# Altium schematic sheet CHARGER_BOARD.SchDoc
size A3; SheetNumber: 1; SheetTotal: 1
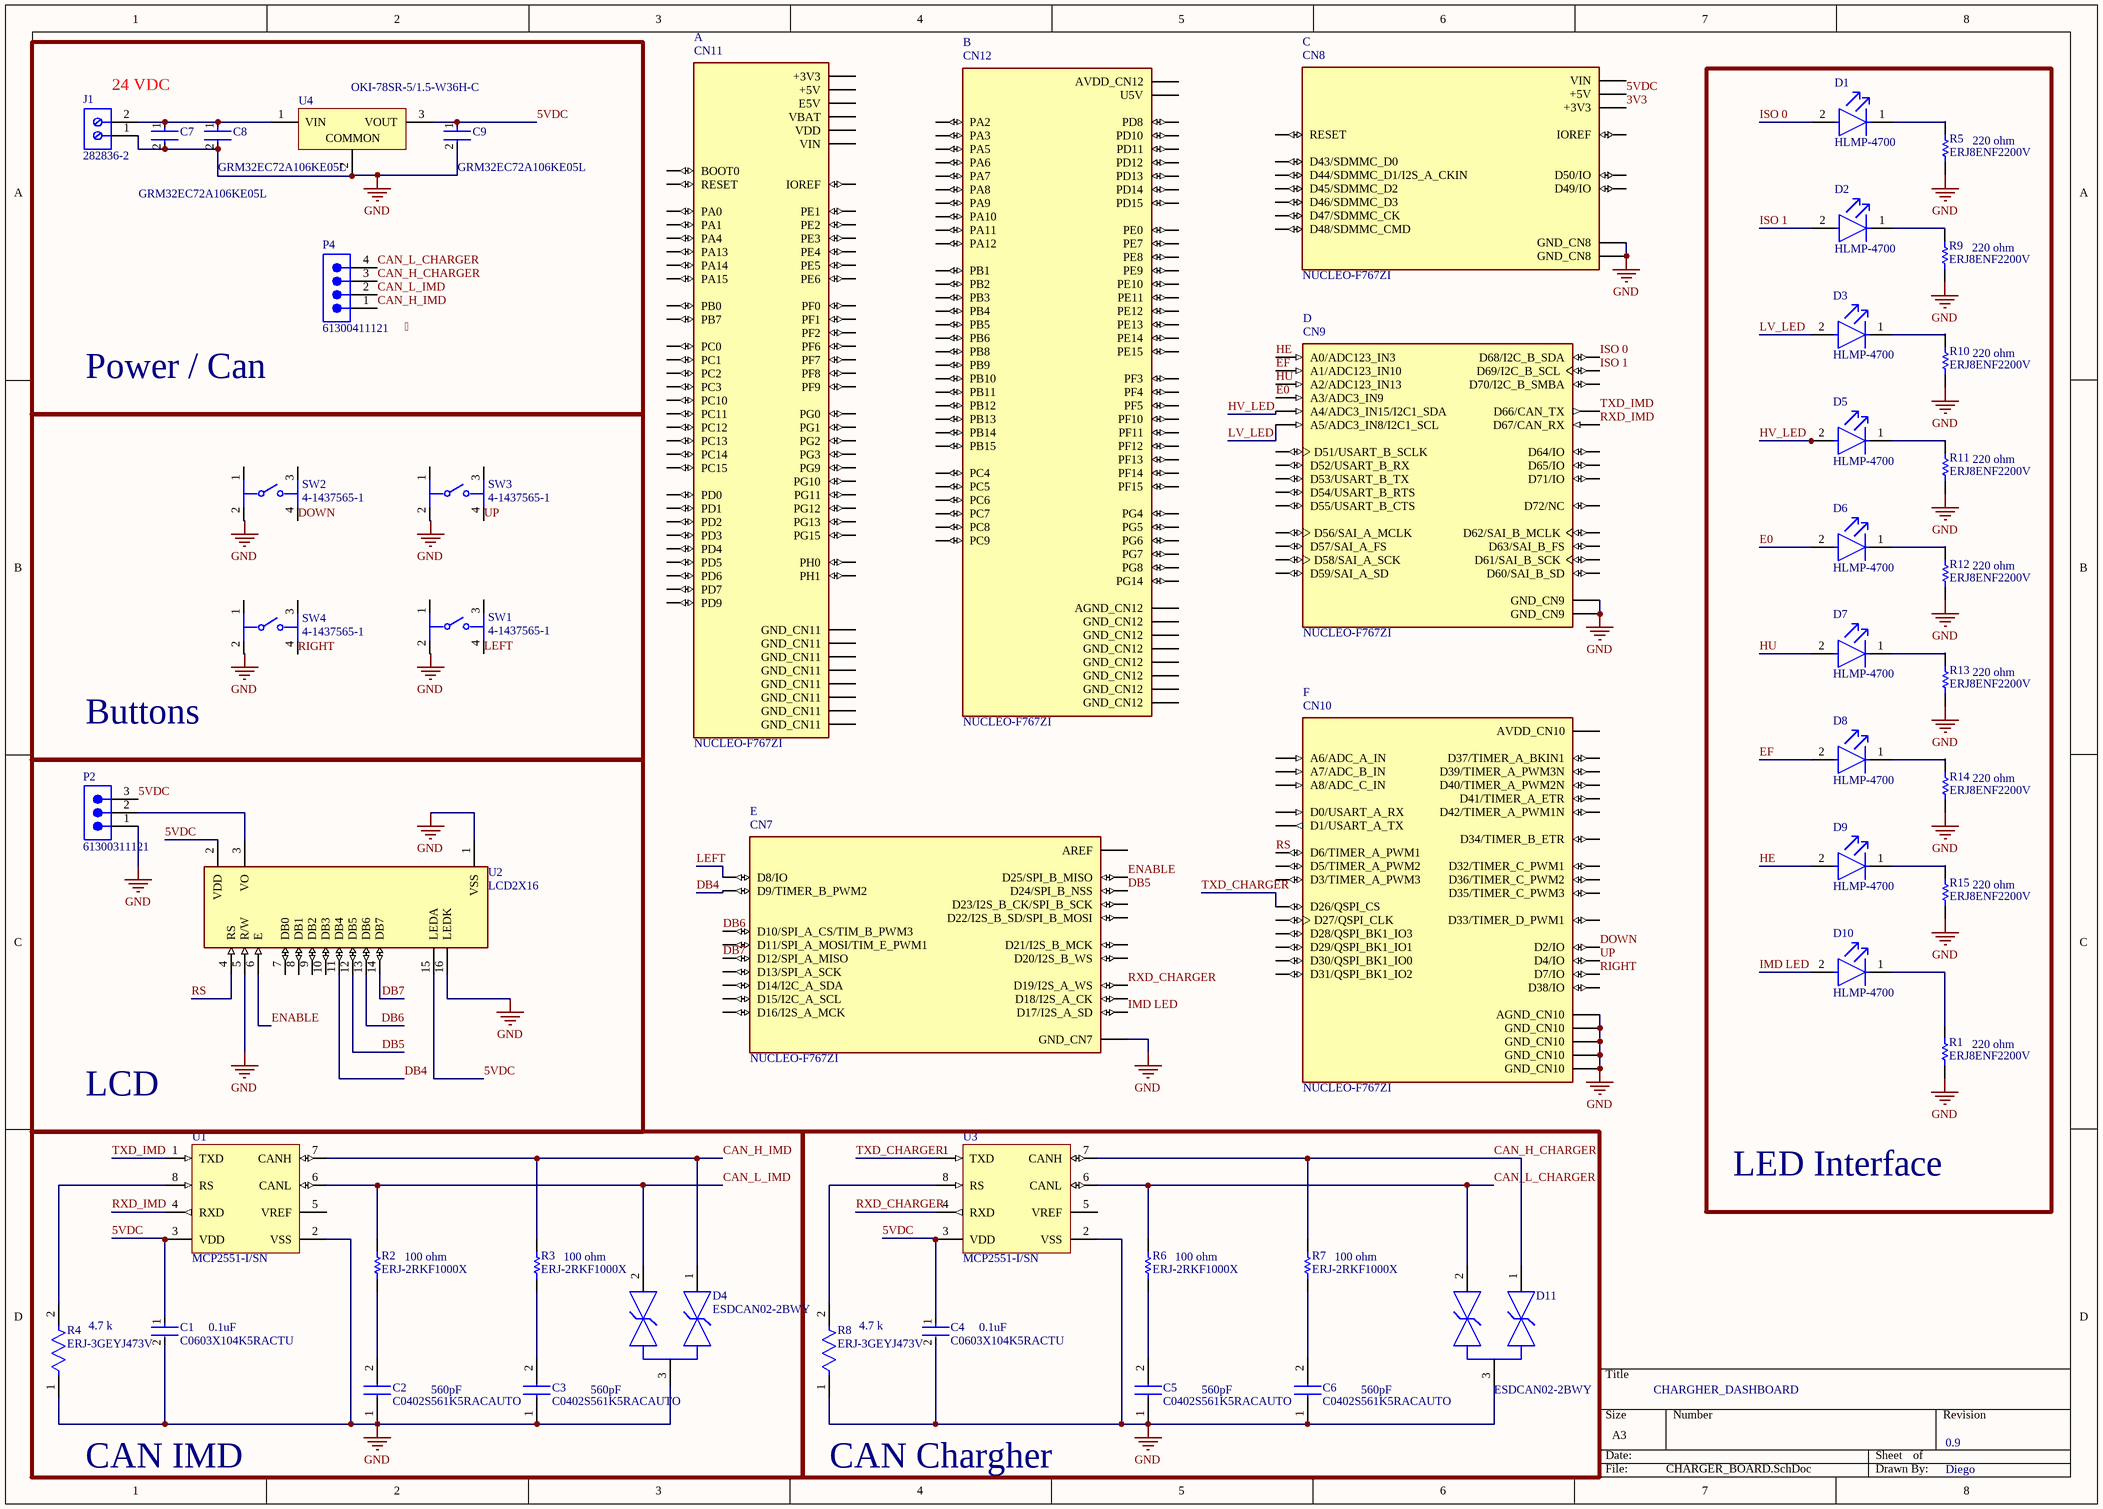
[diagram p0: CHARGER_BOARD.SchDoc]

## Parts
(Parts that share a designator on the sheet are numbered #1, #2 ... from top to bottom, then left to right.)
?#1  NUCLEO-F767ZI  [ST_NUCLEO-F767ZI]  (part C of 6)
?#2  NUCLEO-F767ZI  [ST_NUCLEO-F767ZI]  (part A of 6)
?#3  NUCLEO-F767ZI  [ST_NUCLEO-F767ZI]  (part B of 6)
?#4  NUCLEO-F767ZI  [ST_NUCLEO-F767ZI]  (part D of 6)
?#5  NUCLEO-F767ZI  [ST_NUCLEO-F767ZI]  (part F of 6)
?#6  NUCLEO-F767ZI  [ST_NUCLEO-F767ZI]  (part E of 6)
C1  C0603X104K5RACTU  [FP-C0603-CJ-MFG]
C2  C0402S561K5RACAUTO  [C0402]
C3  C0402S561K5RACAUTO  [C0402]
C4  C0603X104K5RACTU  [FP-C0603-CJ-MFG]
C5  C0402S561K5RACAUTO  [C0402]
C6  C0402S561K5RACAUTO  [C0402]
C7  GRM32EC72A106KE05L  [FP-GRM32E-0_3-0_2-MFG]
C8  GRM32EC72A106KE05L  [FP-GRM32E-0_3-0_2-MFG]
C9  GRM32EC72A106KE05L  [FP-GRM32E-0_3-0_2-MFG]
D1  HLMP-4700  [FP-HLMP-4700-MFG]
D2  HLMP-4700  [FP-HLMP-4700-MFG]
D3  HLMP-4700  [FP-HLMP-4700-MFG]
D4  ESDCAN02-2BWY  [FP-SOT323-3L-MFG]
D5  HLMP-4700  [FP-HLMP-4700-MFG]
D6  HLMP-4700  [FP-HLMP-4700-MFG]
D7  HLMP-4700  [FP-HLMP-4700-MFG]
D8  HLMP-4700  [FP-HLMP-4700-MFG]
D9  HLMP-4700  [FP-HLMP-4700-MFG]
D10  HLMP-4700  [FP-HLMP-4700-MFG]
D11  ESDCAN02-2BWY  [FP-SOT323-3L-MFG]
J1  282836-2  [TECO-282836-2_V]
P2  61300311121  [61300311121]
P4  61300411121  [61300411121]
R1  ERJ8ENF2200V  [RESC3216X70X50NL05T20]
R2  ERJ-2RKF1000X  [RESC1005X40X25LL05T05]
R3  ERJ-2RKF1000X  [RESC1005X40X25LL05T05]
R4  ERJ-3GEYJ473V  [FP-ERJ3G-IPC_B]
R5  ERJ8ENF2200V  [RESC3216X70X50NL05T20]
R6  ERJ-2RKF1000X  [RESC1005X40X25LL05T05]
R7  ERJ-2RKF1000X  [RESC1005X40X25LL05T05]
R8  ERJ-3GEYJ473V  [FP-ERJ3G-IPC_B]
R9  ERJ8ENF2200V  [RESC3216X70X50NL05T20]
R10  ERJ8ENF2200V  [RESC3216X70X50NL05T20]
R11  ERJ8ENF2200V  [RESC3216X70X50NL05T20]
R12  ERJ8ENF2200V  [RESC3216X70X50NL05T20]
R13  ERJ8ENF2200V  [RESC3216X70X50NL05T20]
R14  ERJ8ENF2200V  [RESC3216X70X50NL05T20]
R15  ERJ8ENF2200V  [RESC3216X70X50NL05T20]
SW1  4-1437565-1  [FP-4-1437565-1-MFG]
SW2  4-1437565-1  [FP-4-1437565-1-MFG]
SW3  4-1437565-1  [FP-4-1437565-1-MFG]
SW4  4-1437565-1  [FP-4-1437565-1-MFG]
U1  MCP2551-I/SN  [MCHP-SN8_V]
U2  LCD2X16  [LCD_LCD2X16]
U3  MCP2551-I/SN  [MCHP-SN8_V]
U4  OKI-78SR-5/1.5-W36H-C  [MURA-OKI-78SR-3]

## Blocks framed on the sheet
Power / Can: C7-C9 J1 P4 U4
LED Interface: D1-D3 D5-D10 R1 R5 R9-R15
Buttons: SW1-SW4
LCD: P2 U2
CAN IMD: C1-C3 D4 R2-R4 U1
CAN Chargher: C4-C6 D11 R6-R8 U3

## Nets
GND: ?#1.CN8_11(GND_CN8) ?#1.CN8_13(GND_CN8) ?#4.CN9_12(GND_CN9) ?#4.CN9_23(GND_CN9) ?#5.CN10_3(AGND_CN10) ?#5.CN10_5(GND_CN10) ?#5.CN10_17(GND_CN10) ?#5.CN10_22(GND_CN10) ?#5.CN10_27(GND_CN10) ?#6.CN7_8(GND_CN7) C1.2 C2.1 C3.1 C4.2 C5.1 C6.1 C7.2 C8.2 C9.2 D4.3 D11.3 J1.1 P2.1 R1.1 R4.1 R5.1 R8.1 R9.1 R10.1 R11.1 R12.1 R13.1 R14.1 R15.1 SW1.2 SW2.2 SW3.2 SW4.2 U1.2(VSS) U2.1(VSS) U2.5(R/W) U2.16(LEDK) U3.2(VSS) U4.2(COMMON)
3V3: ?#1.CN8_7(+3V3)
5VDC: ?#1.CN8_9(+5V) C1.1 C4.1 C9.1 P2.3 U1.3(VDD) U2.2(VDD) U2.15(LEDA) U3.3(VDD) U4.3(VOUT)
CAN_H_CHARGER: D11.1 P4.3 R7.2 U3.7(CANH)
CAN_H_IMD: D4.1 P4.1 R3.2 U1.7(CANH)
CAN_L_CHARGER: D11.2 P4.4 R6.2 U3.6(CANL)
CAN_L_IMD: D4.2 P4.2 R2.2 U1.6(CANL)
DB4: ?#6.CN7_18(D9/TIMER_B_PWM2) U2.11(DB4)
DB5: ?#6.CN7_17(D24/SPI_B_NSS) U2.12(DB5)
DB6: ?#6.CN7_16(D10/SPI_A_CS/TIM_B_PWM3) U2.13(DB6)
DB7: ?#6.CN7_12(D12/SPI_A_MISO) U2.14(DB7)
DOWN: ?#5.CN10_12(D2/IO) SW2.4
E0: ?#4.CN9_7(A3/ADC3_IN9) D6.2(A)
EF: ?#4.CN9_3(A1/ADC123_IN10) D8.2(A)
ENABLE: ?#6.CN7_19(D25/SPI_B_MISO) U2.6(E)
HE: ?#4.CN9_1(A0/ADC123_IN3) D9.2(A)
HU: ?#4.CN9_5(A2/ADC123_IN13) D7.2(A)
HV_LED: ?#4.CN9_9(A4/ADC3_IN15/I2C1_SDA) D5.2(A)
IMD LED: ?#6.CN7_3(D17/I2S_A_SD) D10.2(A)
ISO 0: ?#4.CN9_21(D68/I2C_B_SDA) D1.2(A)
ISO 1: ?#4.CN9_19(D69/I2C_B_SCL) D2.2(A)
LEFT: ?#6.CN7_20(D8/IO) SW1.4
LV_LED: ?#4.CN9_11(A5/ADC3_IN8/I2C1_SCL) D3.2(A)
RIGHT: ?#5.CN10_2(D7/IO) SW4.4
RS: ?#5.CN10_4(D6/TIMER_A_PWM1) U2.4(RS)
RXD_CHARGER: ?#6.CN7_7(D19/I2S_A_WS) U3.4(RXD)
RXD_IMD: ?#4.CN9_25(D67/CAN_RX) U1.4(RXD)
TXD_CHARGER: ?#5.CN10_13(D26/QSPI_CS) U3.1(TXD)
TXD_IMD: ?#4.CN9_27(D66/CAN_TX) U1.1(TXD)
UP: ?#5.CN10_8(D4/IO) SW3.4
NetC2_2: C2.2 R2.1
NetC3_2: C3.2 R3.1
NetC5_2: C5.2 R6.1
NetC6_2: C6.2 R7.1
NetC7_1: C7.1 C8.1 J1.2 U4.1(VIN)
NetD1_1: D1.1(C) R5.2
NetD2_1: D2.1(C) R9.2
NetD3_1: D3.1(C) R10.2
NetD5_1: D5.1(C) R11.2
NetD6_1: D6.1(C) R12.2
NetD7_1: D7.1(C) R13.2
NetD8_1: D8.1(C) R14.2
NetD9_1: D9.1(C) R15.2
NetD10_1: D10.1(C) R1.2
NetP2_2: P2.2 U2.3(VO)
NetR4_2: R4.2 U1.8(RS)
NetR8_2: R8.2 U3.8(RS)

Not connected (* = marked no-connect by the designer): ?#1 CN8_2(D43/SDMMC_D0) CN8_3(IOREF) CN8_4(D44/SDMMC_D1/I2S_A_CKIN) CN8_5(RESET) CN8_6(D45/SDMMC_D2) CN8_8(D46/SDMMC_D3) CN8_10(D47/SDMMC_CK) CN8_12(D48/SDMMC_CMD) CN8_14(D49/IO) CN8_15(VIN) CN8_16(D50/IO); ?#2 CN11_1(PC10) CN11_2(PC11) CN11_3(PC12) CN11_4(PD2) CN11_5(VDD) CN11_6(E5V) CN11_7(BOOT0) CN11_8(GND_CN11) CN11_9(PF6) CN11_11(PF7) CN11_12(IOREF) CN11_13(PA13) CN11_14(RESET) CN11_15(PA14) CN11_16(+3V3) CN11_17(PA15) CN11_18(+5V) CN11_19(GND_CN11) CN11_20(GND_CN11) CN11_21(PB7) CN11_22(GND_CN11) CN11_23(PC13) CN11_24(VIN) CN11_25(PC14) CN11_27(PC15) CN11_28(PA0) CN11_29(PH0) CN11_30(PA1) CN11_31(PH1) CN11_32(PA4) CN11_33(VBAT) CN11_34(PB0) CN11_35(PC2) CN11_36(PC1) CN11_37(PC3) CN11_38(PC0) CN11_39(PD4) CN11_40(PD3) CN11_41(PD5) CN11_42(PG2) CN11_43(PD6) CN11_44(PG3) CN11_45(PD7) CN11_46(PE2) CN11_47(PE3) CN11_48(PE4) CN11_49(GND_CN11) CN11_50(PE5) CN11_51(PF1) CN11_52(PF2) CN11_53(PF0) CN11_54(PF8) CN11_55(PD1) CN11_56(PF9) CN11_57(PD0) CN11_58(PG1) CN11_59(PG0) CN11_60(GND_CN11) CN11_61(PE1) CN11_62(PE6) CN11_63(PG9) CN11_64(PG15) CN11_65(PG12) CN11_66(PG10) CN11_68(PG13) CN11_69(PD9) CN11_70(PG11) CN11_71(GND_CN11) CN11_72(GND_CN11); ?#3 CN12_1(PC9) CN12_2(PC8) CN12_3(PB8) CN12_4(PC6) CN12_5(PB9) CN12_6(PC5) CN12_7(AVDD_CN12) CN12_8(U5V) CN12_9(GND_CN12) CN12_10(PD8) CN12_11(PA5) CN12_12(PA12) CN12_13(PA6) CN12_14(PA11) CN12_15(PA7) CN12_16(PB12) CN12_17(PB6) CN12_18(PB11) CN12_19(PC7) CN12_20(GND_CN12) CN12_21(PA9) CN12_22(PB2) CN12_23(PA8) CN12_24(PB1) CN12_25(PB10) CN12_26(PB15) CN12_27(PB4) CN12_28(PB14) CN12_29(PB5) CN12_30(PB13) CN12_31(PB3) CN12_32(AGND_CN12) CN12_33(PA10) CN12_34(PC4) CN12_35(PA2) CN12_36(PF5) CN12_37(PA3) CN12_38(PF4) CN12_39(GND_CN12) CN12_40(PE8) CN12_41(PD13) CN12_42(PF10) CN12_43(PD12) CN12_44(PE7) CN12_45(PD11) CN12_46(PD14) CN12_47(PE10) CN12_48(PD15) CN12_49(PE12) CN12_50(PF14) CN12_51(PE14) CN12_52(PE9) CN12_53(PE15) CN12_54(GND_CN12) CN12_55(PE13) CN12_56(PE11) CN12_57(PF13) CN12_58(PF3) CN12_59(PF12) CN12_60(PF15) CN12_61(PG14) CN12_62(PF11) CN12_63(GND_CN12) CN12_64(PE0) CN12_65(PD10) CN12_66(PG8) CN12_67(PG7) CN12_68(PG5) CN12_69(PG4) CN12_70(PG6) CN12_71(GND_CN12) CN12_72(GND_CN12); ?#4 CN9_2(D51/USART_B_SCLK) CN9_4(D52/USART_B_RX) CN9_6(D53/USART_B_TX) CN9_8(D54/USART_B_RTS) CN9_10(D55/USART_B_CTS) CN9_13(D72/NC) CN9_14(D56/SAI_A_MCLK) CN9_15(D71/IO) CN9_16(D57/SAI_A_FS) CN9_17(D70/I2C_B_SMBA) CN9_18(D58/SAI_A_SCK) CN9_20(D59/SAI_A_SD) CN9_22(D60/SAI_B_SD) CN9_24(D61/SAI_B_SCK) CN9_26(D62/SAI_B_MCLK) CN9_28(D63/SAI_B_FS) CN9_29(D65/IO) CN9_30(D64/IO); ?#5 CN10_1(AVDD_CN10) CN10_6(D5/TIMER_A_PWM2) CN10_7(A6/ADC_A_IN) CN10_9(A7/ADC_B_IN) CN10_10(D3/TIMER_A_PWM3) CN10_11(A8/ADC_C_IN) CN10_14(D1/USART_A_TX) CN10_15(D27/QSPI_CLK) CN10_16(D0/USART_A_RX) CN10_18(D42/TIMER_A_PWM1N) CN10_19(D28/QSPI_BK1_IO3) CN10_20(D41/TIMER_A_ETR) CN10_21(D29/QSPI_BK1_IO1) CN10_23(D30/QSPI_BK1_IO0) CN10_24(D40/TIMER_A_PWM2N) CN10_25(D31/QSPI_BK1_IO2) CN10_26(D39/TIMER_A_PWM3N) CN10_28(D38/IO) CN10_29(D32/TIMER_C_PWM1) CN10_30(D37/TIMER_A_BKIN1) CN10_31(D33/TIMER_D_PWM1) CN10_32(D36/TIMER_C_PWM2) CN10_33(D34/TIMER_B_ETR) CN10_34(D35/TIMER_C_PWM3); ?#6 CN7_1(D16/I2S_A_MCK) CN7_2(D15/I2C_A_SCL) CN7_4(D14/I2C_A_SDA) CN7_5(D18/I2S_A_CK) CN7_6(AREF) CN7_9(D20/I2S_B_WS) CN7_10(D13/SPI_A_SCK) CN7_11(D21/I2S_B_MCK) CN7_13(D22/I2S_B_SD/SPI_B_MOSI) CN7_14(D11/SPI_A_MOSI/TIM_E_PWM1) CN7_15(D23/I2S_B_CK/SPI_B_SCK); SW1 1 3; SW2 1 3; SW3 1 3; SW4 1 3; U1 5(VREF); U2 7(DB0) 8(DB1) 9(DB2) 10(DB3); U3 5(VREF)

## Notes on the sheet
- 24 VDC
- (near R5) 220 ohm
- (near R9) 220 ohm
- (near R10) 220 ohm
- (near R11) 220 ohm
- (near R12) 220 ohm
- (near R13) 220 ohm
- (near R14) 220 ohm
- (near R15) 220 ohm
- (near R1) 220 ohm
- (near R2) 100 ohm
- (near R3) 100 ohm
- (near R6) 100 ohm
- (near R7) 100 ohm
- 4.7 k
- (near C1) 0.1uF
- 560pF
- (near C4) 0.1uF
- CHARGHER_DASHBOARD
- 0.9
- Diego
- Labels drawn without touching a wire or pin: 
- (in symbol NUCLEO-F767ZI, part A) CN11
- (in symbol NUCLEO-F767ZI, part B) CN12
- (in symbol NUCLEO-F767ZI, part C) CN8
- (in symbol NUCLEO-F767ZI, part D) CN9
- (in symbol NUCLEO-F767ZI, part E) CN7
- (in symbol NUCLEO-F767ZI, part F) CN10

## Library data of the parts
?#1-?#6 = NUCLEO-F767ZI: STM32 Nucleo-144 development board with STM32F767ZI MCU, supports Arduino, ST Zio and morpho connectivity; MF: STMicroelectronics; Package: None; MP: NUCLEO-F767ZI; Price: None; Value: *; Availability: Unavailable
C1 C4 = CMP-2006-03300-2: CAP CER 0.1UF 50V X7R 0603; Manufacturer: Kemet; Capacitance: 100nF; Material: Ceramic; Tolerance: 10%; Value: 100nF; Temperature Coefficient: 15%; Temperature Range High: +125°C; Temperature Range Low: -55°C; Manufacturer Part Number: C0603X104K5RACTU; Voltage: 50V; ComponentLink2Description: Datasheet; RoHS: TRUE; ComponentLink2URL: https://content.kemet.com/datasheets/KEM_C1013_X7R_FT-CAP_SMD.pdf; Device Class L3: Ceramic Capacitors; Device Class L2: Capacitors; Package: C0603-CJ; Height: 0.95mm; Device Class L1: Passive Components; Temperature Characteristic: X7R; Lead Free: Yes; Digikey Description: CAP CER 0.1UF 50V X7R 0603; Automotive: No; Mouser Description: Capacitor; Ceramic; Cap 0.1uF; Tol+10%; SMT; Flexible Termination; Vol-Rtg 50V; TR; Temperature: -55°C to +125°C; Octopart: https://octopart.com/c0603x104k5ractu-kemet-9145062; Category: Cap; Voltage Rating: 50V; Ipc Land Pattern Name: CAPC16080X80
C2 C3 C5 C6 = C0402S561K5RACAUTO: Capacitor; Manufacturer_Name: KEMET; Datasheet Link: https://content.kemet.com/datasheets/KEM_C1014_X7R_FE-CAP_SMD.pdf; Height: 0.55mm; Manufacturer_Part_Number: C0402S561K5RACAUTO; Mouser Part Number: 80-C0402S561K5RAUTO; Mouser Price/Stock: https://www.mouser.co.uk/ProductDetail/KEMET/C0402S561K5RACAUTO?qs=hzBznG4dWXUfSq1zMHOt5w%3D%3D
C7-C9 = CMP-06035-000081-2: Chip Multilayer Ceramic Capacitors for General Purpose, 1210, 10uF, X7S, 22%, 10%, 100V; Case Code (Metric): 3225; Case/Package: 1210; Case Code (Imperial): 1210; Voltage Rating: 100V; Capacitance: 10uF; Packaging: Tape and Reel; Mount: Surface Mount; Min Operating Temperature: -55°C; Max Operating Temperature: 125°C; Tolerance: 10%
D1-D3 D5-D10 = CMP-18399-000008-1: LED RED DIFFUSED T-1 3/4 T/H; Manufacturer: Broadcom; Luminous Intensity: 2.3mcd; Peak Emmision Wavelength: 635nm; Forward Voltage: 1.7V; Viewing Angle: 50°; Led Orientation: Straight; Reverse Voltage: 5V; Forward Current: 2mA; Power Dissipation: 14mW; Wavelength: 626nm; Digikey Description: LED RED DIFFUSED T-1 3/4 T/H; Device Class L3: unset; Temperature Range Low: -40°C; Temperature Range High: +100°C; RoHS: TRUE; Package: HLMP-4700; Octopart: https://octopart.com/hlmp-4700-broadcom-71130526; Automotive: No; ComponentLink2URL: https://docs.broadcom.com/docs/AV02-1557EN; Colour: Red; Temperature: -40°C to +100°C; Lead Free: Yes; Category: Diode; ComponentLink2Description: Datasheet; Manufacturer Part Number: HLMP-4700; Device Class L1: Optoelectronics; Device Class L2: LEDs; Mouser Description: LED; Red; 2.3mcd; 0.24In.Dia.; T-1-3/4; 500mA; 1.7V; 635nm; 50deg; 5V; 24mW; -55degC;
D4 D11 = CMP-12225-000055-1: TVS DIODE 26.5V 44V SOT323-3; Manufacturer: STMicroelectronics; Value: 3pF; Direction: Bidirectional; Breakdown Voltage: 28.5V; Automotive Grade: Grade 0; Standoff Height: 0mm; Peak Pulse Power: 170W; Peak Pulse Current: 3A; Number Of Channels: 2; Max Junction Temp: +175°C; Mouser Description: TVS Diodes / ESD Suppressors Automotive dual-line Transil, Transient voltage suppressor (TVS) for CAN bus; Height: 1.1mm; Category: Diode; Reverse Standoff Voltage: 26.5V; Device Class L1: Circuit Protection; Temperature: -55°C to +175°C; RoHS: TRUE; ComponentLink2URL: https://www.st.com/resource/en/datasheet/esdcan02-2bwy.pdf; Device Class L3: unset; Device Class L2: TVS Diodes; Temperature Range High: +175°C; Octopart: https://octopart.com/esdcan02-2bwy-stmicroelectronics-58631133; Ipc Land Pattern Name: SOT65P210X95-3; Temperature Range Low: -55°C; Capacitance: 3pF; Digikey Description: TVS DIODE 26.5V 44V SOT323-3; Automotive: Yes; ComponentLink2Description: Datasheet; Clamping Voltage: 44V; Manufacturer Part Number: ESDCAN02-2BWY; Lead Free: Yes; Package: SOT323-3L
J1 = CMP-1684-00017-1: Female Header, Pitch 5 mm, 1 x 2 Position, Height 10 mm, Tail Length 3.5 mm, Rohs, Bulk; Manufacturer: TE Connectivity; Wire Gauge: 16-30AWG; Product Training Modules: Wire-to-BoardEurostyleTerminalBlocks; Clamp Material - Plating: Brass-NickelPlated; Voltage: 300V; Mating Orientation: HorizontalwithBoard; Current: 13.5A; Pitch: 0.197"(5.00mm); Screw Thread: M3; 3D Model: 282836-2.pdf; Other Names: 5ULV-02B / A98076; Dynamic Catalog: BuchananSeries; Number of Levels: 1; Torque - Screw: 0.68Nm(6Lb-In); Featured Product: EurostyleTerminalBlockConnectors; Positions Per Level: 2; Wire Termination: Screw-RisingCageClamp; Datasheet URL: http://www.te.com.cn/commerce/DocumentDelivery/DDEController?Action=showdoc&DocId=Catalog+Section%7F1308389_EUROSTYLE_TERMINAL_BLOCKS%7F0607%7Fpdf%7FEnglish%7FENG_CS_1308389_EUROSTYLE_TERMINAL_BLOCKS_0607.pdf%7F282836-2; Color: Green; Family: TerminalBlocks-WiretoBoard; RoHS Information: 282836-2StatementofCompliance; Standard Package: 300; Contact Material - Plating: Brass-TinPlated; Manufacturer URL: http://www.te.com; Housing Material: Polyamide(PA66),Nylon6/6; Features: Interlocking(Side); Package Description: Female Header, Pitch 5 mm, 1 x 2 Position, Height 10 mm, Tail Length 3.5 mm; Mounting Type: ThroughHole; Package Reference: THD; Packaging: Bulk; Series: Buchanan; Category: Connectors,Interconnects; Screw Material - Plating: Brass-NickelPlated
P2 = CMP-1502-01062-2: NexarPartId: 32855521; Voltage Rating: 250V; Current Rating: 3A; Connector Type: Male Pin; Number of Positions: 3; Gender: Male; Contact Resistance: 20mΩ; Pitch: 2.54mm; Max Operating Temperature: 105°C; Lead Pitch: 2.54mm; Lead Free: Lead Free; Contact Mating Length: 5.9944mm; Contact Material: Copper; Number of Pins: 3; Orientation: Vertical; Height: 8.94mm; Packaging: Bulk; Min Operating Temperature: -40°C; Mount: Through Hole; RoHS: Compliant; Number of Contacts: 3; Operating Supply Voltage: 250V; Termination: Solder; Number of Rows: 1; Contact Plating: Gold; Color: Black; REACH SVHC: Unknown
P4 = CMP-1502-01064-2: NexarPartId: 32855522; Pitch: 2.54mm; Number of Contacts: 4; Contact Resistance: 20mΩ; Gender: Male; Current Rating: 3A; Connector Type: Male Pin; Voltage Rating: 250V; Lead Free: Lead Free; Contact Plating: Gold; Max Operating Temperature: 105°C; Packaging: Bulk; Height: 8.89mm; Orientation: Vertical; Contact Mating Length: 5.9944mm; Contact Material: Copper; Lead Pitch: 2.54mm; Min Operating Temperature: -40°C; Termination: Solder; Color: Black; Number of Rows: 1; REACH SVHC: Unknown; RoHS: Compliant; Mount: Through Hole; Number of Positions: 4; Number of Pins: 4; Operating Supply Voltage: 250V
R1 R5 R9-R15 = CMP-2003-00217-1: Manufacturer: Panasonic; Part Number: ERJ8ENF2200V
R2 R3 R6 R7 = CMP-2002-00605-3: Chip Resistor, 100 Ohm, +/- 1%, 100 mW, -55 to 155 degC, 0402 (1005 Metric), RoHS, Tape and Reel; Manufacturer: Basic Passives; Power Rating: 100 mW; Resistance: 100 Ohm; Voltage Rating: 50 V; Case\/Package: 0402; Width: 0.5 mm; Pins: 2; ComponentLink2Description: Datasheet; PackageReference: 0402; Height: 0.35 mm; Tolerance: 1%; DatasheetVersion: 04/2015; Case Code (Imperial): 0402; Min Operating Temperature: -55 degC; Radiation Hardening: No; Length: 1 mm; Package Quantity: 10000; PackageDescription: 2-Pin Surface Mount Device, Body 1 x 0.5 mm; Mounting Technology: Surface Mount; Case Code (Metric): 1005; Packaging: Tape and Reel; ComponentLink1URL: http://www.panasonic.com/; RoHSCompliant: true; Max Operating Temperature: 155 degC; REACH SVHC: Yes; PartNumber: ERJ-2RKF1000X; ComponentLink1Description: Manufacturer URL; ComponentLink2URL: http://industrial.panasonic.com/cdbs/www-data/pdf/RDA0000/AOA0000C86.pdf; Mount: Surface Mount
R4 R8 = CMP-1012-00114-3: RES SMD 47K OHM 5% 1/10W 0603; Resistance: 47kR; Max Power Dissipation: 100mW; Working Voltage: 75V; Temperature Coefficient: 200ppm/°C; Voltage Rating (DC): 50V; Package Quantity: 1; Case/Package: 0603; Military Standard: Not; Construction: Rectangular; Height: 0.45mm; Length: 1.6mm; Depth: 0.8mm; Packaging: Tape and Reel; Termination: SMD/SMT; Technology: THICK FILM; Tolerance: 5%; Min Operating Temperature: -55°C; Features: Automotive AEC-Q200; Power Rating: 100mW; Contact Plating: Tin; Width: 0.031inch; Mount: Surface Mount; Number of Terminations: 2; Resistance Tolerance: 5%; Max Operating Temperature: 155°C; REACH SVHC: No SVHC; Series: ERJ; Resistor Type: Thick Film; Lead Free: Lead Free; Radiation Hardening: No; Voltage Rating: 75V; RoHS Compliant: Yes; Case Code (Imperial): 0603; Case Code (Metric): 1608
SW1-SW4 = CMP-03407-000003-1: SWITCH TACTILE SPST-NO 0.05A 24V; Manufacturer: TE Connectivity; Ciiva Ids: 2672442; Contact Current Rating: 50mA; Operating Force: 160gf; Contact Resistance: 100mΩ; Electromechanical Life: 100000Cycles; Standoff Height: 0.05mm; Import Ts: 1521848451; Category: Switch; ComponentLink2Description: Datasheet; Mount: Surface Mount; Digikey Description: SWITCH TACTILE SPST-NO 0.05A 24V; Device Class L3: Tactile Switches; Release Date: 1503379960; Octopart: https://octopart.com/fsm4jsma-te+connectivity-55488004; Temperature Range Low: -35°C; Lead Free: Yes; RoHS: TRUE; Mouser Description: Switch Tactile OFF (ON) SPST Round Button Gull Wing 0.05A 12VDC 1.57N SMD Loose Piece; Voltage Rating Dc: 24V; ComponentLink2URL: https://www.te.com/commerce/DocumentDelivery/DDEController?Action=showdoc&DocId=Customer+Drawing%7F2-1437565-7%7FV%7Fpdf%7FEnglish%7FENG_CD_2-1437565-7_V.pdf%7F4-1437565-1; Height: 5.38mm; Package: 0; Temperature Range High: +85°C; Device Class L2: Switches; Manufacturer Part Number: 4-1437565-1; Temperature: -35°C to +85°C; Device Class L1: Electromechanical; Automotive: No; Throw Configuration: SPST-NO
U1 U3 = CMP-0186-00138-3: High-Speed CAN Transceiver, / 1 Mb/s, 4.5 to 5.5 V, 8-Pin SOIC (SN), Industrial Temperature, RoHS, Tube; Manufacturer: Microchip; RoHSCompliant: true; PackageReference: SN8; ComponentLink1URL: http://www.microchip.com/; DatasheetVersion: Rev. F, 07/2010; ComponentLink2Description: Datasheet; ComponentLink2URL: http://ww1.microchip.com/downloads/en/DeviceDoc/21667f.pdf; ComponentLink3Description: Package Specification; PackageDescription: 8-Pin Small Outline Integrated Circuit, Body 4.9 x 3.9 mm, Pitch 1.27 mm; ComponentLink1Description: Manufacturer URL; Mounting Technology: Surface Mount; ComponentLink3URL: http://www.microchip.com/stellent/groups/techpub_sg/documents/packagingspec/en012702.pdf
U2 = CMP-007-000000-1: Display; Display: LCD 2x16 characters (blue backlight); MP: LCD2X16; Pin Count: 16; Component Type: Standard; Source: LCD2X16.SchLib; Package: None; Design Item ID: LCD2X16; Availability: Unavailable; Price: None; Value: *
U4 = CMP-2000-05275-1: DC / DC Converter, 5 V, 1.5 A, -40 to 85 degC, 3-Pin SIP, RoHS, Tray; Manufacturer: Murata; Power (Watts) - Manufacture Series: 8W; Efficiency: 90.5%; Other Names: 811-2692OKI78SR515W36HC; Voltage - Input (Max): 36V; Current - Output (Max): 1.5A; Voltage - Input (Min): 7V; Voltage - Output 1: 5V; Number of Outputs: 1; HTML Datasheet: OKI-78SRSeries.html; Online Catalog: Okami™OKI-78SRSeries; Voltage - Output 3: -; Manufacturer URL: http://www.murata.com/; Features: SCP; Size / Dimension: 0.41"Lx0.30"Wx0.65"H(10.4mmx7.6mmx16.5mm); Power (Watts) - Max: 8W; Datasheet URL: http://www.mouser.com/ds/2/281/oki-78sr-56393.pdf; Category: PowerSupplies-BoardMount; Family: DCDCConverters; Voltage - Output 2: -; Operating Temperature: -40degC~85degC; Datasheet Version: Oct-14; Applications: ITE(Commercial); Voltage - Isolation: -; Standard Package: 100; Type: LinearRegulatorReplacement; Mounting Type: ThroughHole; Packaging: Tray; Series: Okami™OKI-78SR; Package / Case: 3-SIPModule